# Altium schematic sheet Esquematico.SchDoc
size A3; SheetNumber: 1; SheetTotal: 1
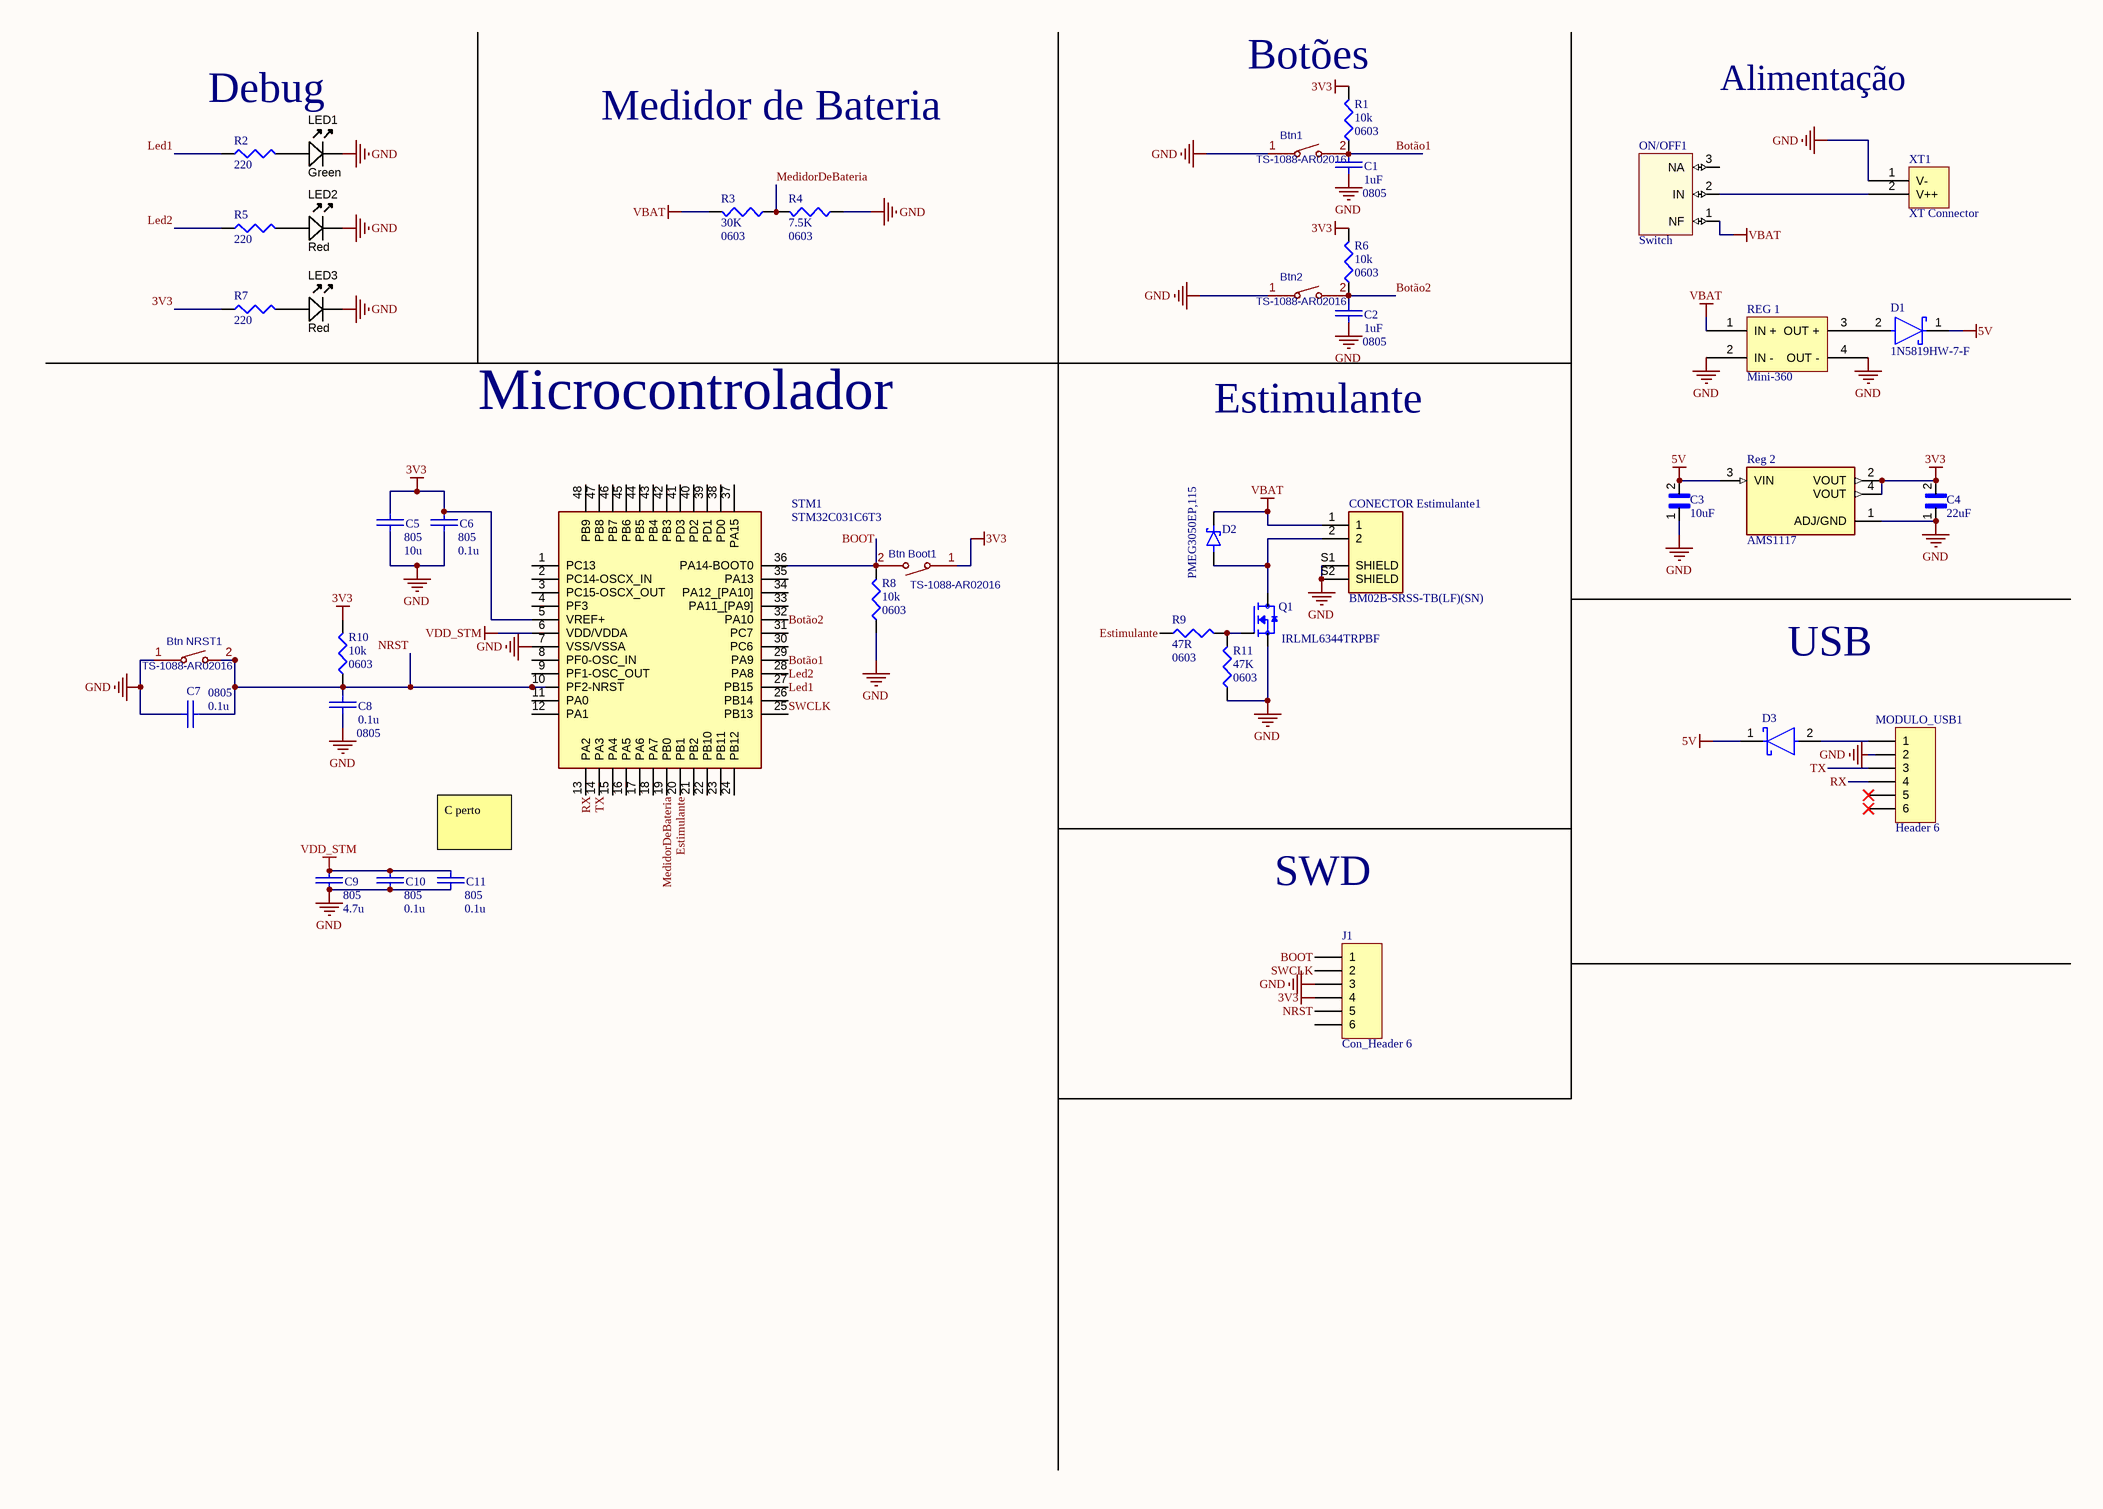
[diagram p0: Esquematico.SchDoc]

## Parts
Btn1  TS-1088-AR02016  [SW-SMD_L3.9-W3.0-P4.45]
Btn2  TS-1088-AR02016  [SW-SMD_L3.9-W3.0-P4.45]
Btn_Boot1  TS-1088-AR02016  [SW-SMD_L3.9-W3.0-P4.45]
Btn_NRST1  TS-1088-AR02016  [SW-SMD_L3.9-W3.0-P4.45]
C1  0805  value 1uF  [CAPC0805]
C2  0805  value 1uF  [CAPC0805]
C3  10uF  [Capacitor_SMD_603]
C4  22uF  [Capacitor_SMD_603]
C5  805  value 10u  [CAPC0805]
C6  805  value 0.1u  [CAPC0805]
C7  0805  value 0.1u  [CAPC0805]
C8  0805  value 0.1u  [CAPC0805]
C9  805  value 4.7u  [CAPC0805]
C10  805  value 0.1u  [CAPC0805]
C11  805  value 0.1u  [CAPC0805]
CONECTOR_Estimulante1  BM02B-SRSS-TB(LF)(SN)  [JST_BM02B-SRSS-TB(LF)(SN)]
D1  1N5819HW-7-F  [FP-SOD123-MFG]
D2  PMEG3050EP,115  [DIO_PMEG3050EP,115]
D3  1N5819HW-7-F  [FP-SOD123-MFG]  (value not drawn)
J1  Con_Header 6  [Header1x6]
LED1  Green  [LED-0603-GREEN]
LED2  Red  [LED-0603-GREEN]
LED3  Red  [LED-0603-GREEN]
MODULO_USB1  Header 6  [Header1x6]
ON/OFF1  Switch  [Switch]
Q1  IRLML6344TRPBF  [TRANS_IRLML6344TRPBF]
R1  value 10k  Size: 0603  [Resistor SMD 0603]  (hidden comment: Resistor SMD)
R2  value 220  [Resistor SMD 0603]  (hidden comment: Resistor SMD)
R3  value 30K  Size: 0603  [Resistor SMD 0603]  (hidden comment: Resistor SMD)
R4  value 7.5K  Size: 0603  [Resistor SMD 0603]  (hidden comment: Resistor SMD)
R5  value 220  [Resistor SMD 0603]  (hidden comment: Resistor SMD)
R6  value 10k  Size: 0603  [Resistor SMD 0603]  (hidden comment: Resistor SMD)
R7  value 220  [Resistor SMD 0603]  (hidden comment: Resistor SMD)
R8  value 10k  Size: 0603  [Resistor SMD 0603]  (hidden comment: Resistor SMD)
R9  value 47R  Size: 0603  [Resistor SMD 0603]  (hidden comment: Resistor SMD)
R10  value 10k  Size: 0603  [Resistor SMD 0603]  (hidden comment: Resistor SMD)
R11  value 47K  Size: 0603  [Resistor SMD 0603]  (hidden comment: Resistor SMD)
REG_1  Mini-360  [Mini-360 baixo]
Reg_2  AMS1117  [SOT229P700X180-4N]
STM1  STM32C031C6T3  [QFP50P900X900X160-48N]
XT1  XT Connector  [XT30]

## Nets
3V3: Btn_Boot1.1 C4.2 C5.2 C6.2 J1.4 R1.2 R6.2 R7.1 R10.2 Reg_2.2(VOUT) Reg_2.4(VOUT) STM1.5(VREF+)
5V: C3.2 D1.1(C) D3.1(C) Reg_2.3(VIN)
GND: Btn1.1 Btn2.1 Btn_NRST1.1 C1.2 C2.2 C3.1 C4.1 C5.1 C6.1 C7.2 C8.2 C9.1 C10.1 C11.1 CONECTOR_Estimulante1.S1(SHIELD) CONECTOR_Estimulante1.S2(SHIELD) J1.3 LED1.K LED2.K LED3.K MODULO_USB1.2 Q1.2(S) R4.1 R8.1 R11.1 REG_1.2(IN_-) REG_1.4(OUT_-) Reg_2.1(ADJ/GND) STM1.7(VSS/VSSA) XT1.1(V-)
VBAT: CONECTOR_Estimulante1.1 D2.K ON/OFF1.1(NF) R3.2 REG_1.1(IN_+)
VDD_STM: C9.2 C10.2 C11.2 STM1.6(VDD/VDDA)
BOOT: Btn_Boot1.2 J1.1 R8.2 STM1.36(PA14-BOOT0)
Botão1: Btn1.2 C1.1 R1.1 STM1.29(PA9)
Botão2: Btn2.2 C2.1 R6.1 STM1.32(PA10)
Estimulante: R9.1 STM1.20(PB1)
Led1: R2.1 STM1.27(PB15)
Led2: R5.1 STM1.28(PA8)
MedidorDeBateria: R3.1 R4.2 STM1.19(PB0)
NRST: Btn_NRST1.2 C7.1 C8.1 J1.5 R10.1 STM1.10(PF2-NRST)
RX: MODULO_USB1.4 STM1.13(PA2)
SWCLK: J1.2 STM1.25(PB13)
TX: MODULO_USB1.3 STM1.14(PA3)
NetCONECTOR_Estimulante1_2: CONECTOR_Estimulante1.2 D2.A Q1.3(D)
NetD1_2: D1.2(A) REG_1.3(OUT_+)
NetD3_2: D3.2(A) MODULO_USB1.1
NetLED1_A: LED1.A R2.2
NetLED2_A: LED2.A R5.2
NetLED3_A: LED3.A R7.2
NetON/OFF1_2: ON/OFF1.2(IN) XT1.2(V++)
NetQ1_1: Q1.1(G) R9.2 R11.2

Not connected (* = marked no-connect by the designer): J1 6; MODULO_USB1 5* 6*; ON/OFF1 3(NA); STM1 1(PC13) 2(PC14-OSCX_IN) 3(PC15-OSCX_OUT) 4(PF3) 8(PF0-OSC_IN) 9(PF1-OSC_OUT) 11(PA0) 12(PA1) 15(PA4) 16(PA5) 17(PA6) 18(PA7) 21(PB2) 22(PB10) 23(PB11) 24(PB12) 26(PB14) 30(PC6) 31(PC7) 33(PA11_[PA9]) 34(PA12_[PA10]) 35(PA13) 37(PA15) 38(PD0) 39(PD1) 40(PD2) 41(PD3) 42(PB3) 43(PB4) 44(PB5) 45(PB6) 46(PB7) 47(PB8) 48(PB9)

## Notes on the sheet
- Debug
- (near R1) Botões
- Alimentação
- Medidor de Bateria
- Microcontrolador
- Estimulante
- USB
- (near C11) C perto
- SWD
- THIS DOCUMENT AND THE DATA DISCLOSED HEREIN OR
- HEREWITH IS THE PROPERTY OF ALTIUM LIMITED AND MAY
- DWG NO:
- REVISION
- REV:
- DESCRIPTION
- DATE
- APPROVED
- BE FREELY DISTRIBUTED IN WHOLE. NO RIGHTS ARE
- RESERVED OR EXPRESS OR IMPLIED WARANTEE GIVEN.
- ENG:
- APPROVALS
- PROJECT
- DSN:
- CHK:
- REFERENCE DOCUMENTS
- PROJECT REVISION:
- TITLE
- DOCUMENT REVISION:
- DESIGN ITEM:
- BOM:
- FAB DWG:
- PCB DWG:
- ASSY DWG:
- SCALE:
- A3
- SIZE
- CAGE CODE
- FILE NAME
- DWG NO.
- SHEET
- OF
- REV

## Library data of the parts
Btn1 Btn2 Btn_Boot1 Btn_NRST1 = TS-1088-AR02016: Manufacturer: XUNPU(讯普); Contributor: LCSC; Supplier: LCSC; Supplier Part: C720477; Manufacturer Part: TS-1088-AR02016; JLCPCB Part Class: Extended Part; spicePre: S; spiceSymbolName: TS-1088-AR02016
C1 C2 C5-C11 = Capacitor SMD 0805: Capacitor
C3 C4 = Capacitor_Ceramico: Cap Ceramic 0.022uF 16V X7R 10% SMD 0603 125Ã‚Â°C Paper T/R; MP: 0603YC223KAT2A; Package: None; Price: None; Value: *; Availability: Unavailable
CONECTOR_Estimulante1 = BM02B-SRSS-TB(LF)(SN): Conn Shrouded Header (4 Sides) HDR 2 POS 1mm Solder ST Top Entry SMD T/R; MF: JST Sales America Inc.; MP: BM02B-SRSS-TB(LF)(SN); Package: None; Check_prices: https://www.snapeda.com/parts/BM02B-SRSS-TB(LF)(SN)/JST/view-part/?ref=eda; SnapEDA_Link: https://www.snapeda.com/parts/BM02B-SRSS-TB(LF)(SN)/JST/view-part/?ref=snap; Availability: In Stock; Price: None; Value: *
D1 D3 = CMP-0303-00003-3: DIODE SCHOTTKY 40V 1A SOD123; Forward Voltage: 450mV; Capacitance: 110pF; Max Forward Surge Current (Ifsm): 25A; Peak Reverse Current: 50uA; Polarity: Standard; Element Configuration: Single; Max Power Dissipation: 450mW; Min Operating Temperature: -65°C; Package Quantity: 3000; Contact Plating: Tin; Weight: 0.000353oz; Max Repetitive Reverse Voltage (Vrrm): 40V; Max Reverse Voltage (DC): 40V; Height: 1.25mm; Average Rectified Current: 1A; Width: 1.7mm; Case/Package: SOD-123-2; Lead Free: Lead Free; Max Operating Temperature: 125°C; Current Rating: 1A; Termination: SMD/SMT; Forward Current: 1A; Radiation Hardening: No; Number of Pins: 2; Length: 2.85mm; Voltage Rating (DC): 40V; REACH SVHC: No SVHC; Peak Non-Repetitive Surge Current: 25A; Packaging: Tape and Reel; Output Current: 1A
D2 = PMEG3050EP,115: <a href="https://pricing.snapeda.com/parts/PMEG3050EP%2C115/Nexperia%20USA%20Inc./view-part?ref=eda">Check availability</a>; MF: {'manufacturer': u'Nexperia USA Inc.'}; Package: None; Price: None; Value: *; MP: PMEG3050EP,115; Availability: Unavailable
J1 = Con_Header 6: Header, 6-Pin; LatestRevisionDate: 17-Jul-2002; LatestRevisionNote: Re-released for DXP Platform.; Publisher: Altium Limited
LED1-LED3 = LED_SMD_Green_0603_570nm: LED 0603 SMD Green 570nm 50mcd 20mA; Manufacturer 1: Kingbright Company LLC; Manufacturer Part Number 1: APT1608CGCK; Material: AlGaInP; Ratings: 20mcd min; 50 mcd typ; 570 nm; Voltage - Forward (Vf) Typ: 2.1V; Viewing Angle: 120°; Lens Style/Size: Rectangle with Flat Top, 1.1mm x 0.8mm; Voltage - Forward (Vf) @ 10mA: 2.0V; SCDType: source; Wavelength - Peak: 574nm; Lens Type: Clear; Package / Case: 0603 (1608 metric); Color: Green; Current - Test: 20mA; Supplier 1: Digi-Key; Supplier Part Number 1: 754-1116-1-ND; RoHS 1: RoHS Compliant; Wavelength - Dominant: 570nm; ComponentLink1URL: http://www.us.kingbright.com/images/catalog/SPEC/APT1608CGCK.pdf; ComponentLink1Description: http://www.us.kingbright.com/images/catalog/SPEC/APT1608CGCK.pdf
MODULO_USB1 = Header 6: Header, 6-Pin; LatestRevisionDate: 17-Jul-2002; LatestRevisionNote: Re-released for DXP Platform.; Publisher: Altium Limited
R1-R11 = Resistor SMD: Resistor SMD com os tamanhos 0603, 0805, 1206 e 1210
REG_1 = Mini-360: Módulo Regulador de Tensão Step Down Buck DC-DC Mini 360 3A
Reg_2 = AMS1117: UNO PLUS Arduino R3 Shield, Xbee Arduino IDE Wheeled Robotics Kit; MF: Seeed Technology; Availability: Unavailable; SnapEDA_Link: https://www.snapeda.com/parts/AMS1117/Seeed%20Technology%20Co.%2C%20Ltd/view-part/184428/?ref=snap; MP: AMS1117; Price: None; Value: *; Package: SOT-223 Seeed Technology
STM1 = STM32C031C6T3: Integrated Circuit; Manufacturer_Name: STMicroelectronics; Datasheet Link: https://www.st.com/resource/en/datasheet/stm32c031c4.pdf; Height: 1.6mm; Manufacturer_Part_Number: STM32C031C6T3
Q1 = IRLML6344TRPBF: Package: None; Price: None; Value: *; MP: IRLML6344TRPBF; Availability: Unavailable